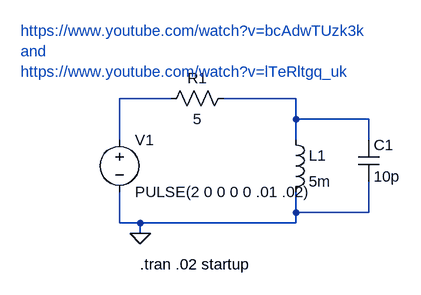
[diagram p0: schematic inductor1.asc]
inductor1.asc, the LTspice schematic file:
Version 4
SHEET 1 880 680
WIRE 192 208 112 208
WIRE 384 208 272 208
WIRE 384 240 384 208
WIRE 496 240 384 240
WIRE 112 272 112 208
WIRE 384 272 384 240
WIRE 496 272 496 240
WIRE 384 384 384 352
WIRE 496 384 496 336
WIRE 496 384 384 384
WIRE 112 400 112 352
WIRE 144 400 112 400
WIRE 384 400 384 384
WIRE 384 400 144 400
WIRE 144 416 144 400
FLAG 144 416 0
SYMBOL voltage 112 256 R0
SYMATTR InstName V1
SYMATTR Value PULSE(2 0 0 0 0 .01 .02)
SYMBOL res 288 192 R90
WINDOW 0 0 56 VBottom 2
WINDOW 3 32 56 VTop 2
SYMATTR InstName R1
SYMATTR Value 5
SYMBOL ind 368 256 R0
SYMATTR InstName L1
SYMATTR Value 5m
SYMBOL cap 480 272 R0
SYMATTR InstName C1
SYMATTR Value 10p
TEXT 144 464 Left 2 !.tran .02 startup
TEXT -40 104 Left 2 ;https://www.youtube.com/watch?v=bcAdwTUzk3k\nand\nhttps://www.youtube.com/watch?v=lTeRltgq_uk

The netlist it stands for:
* inductor1.asc
V1 N001 0 PULSE(2 0 0 0 0 .01 .02)
R1 N002 N001 5
L1 N002 0 5m
C1 N002 0 10p
.tran .02 startup
* https://www.youtube.com/watch?v=bcAdwTUzk3k
* and
* https://www.youtube.com/watch?v=lTeRltgq_uk
.backanno
.end